# Altium schematic sheet NNP-DWG-125-001-000 PG4 Schematic Drawing Pg3.SchDoc
size B; CheckedBy: A. Zbrzeski; DrawnBy: R.Yoder; Engineer: R.Yoder; Organization: Synapse Biomedical Inc.; Address1: 300 Artino St.; Address2: Oberlin, OH 44074; DocumentNumber: 51-2002-01; Revision: 04; SheetNumber: 3; SheetTotal: 8; PageSetup: Record=PageOptions|CenterHorizontal=True|CenterVertical=True|PrintScale=1.09|XCorrection=1.00|YCorrection=1.00|PrintKind=0|BorderSize=5000000|LeftOffset=0|BottomOffset=0|Orientation=2|PaperLength=4318|PaperWidth=2794|Scale=100|PaperSource=7|PrintQuality=-3|MediaType=1|DitherType=10|PrintScaleMode=1|PaperKind=11" x 17"|PaperIndex=17
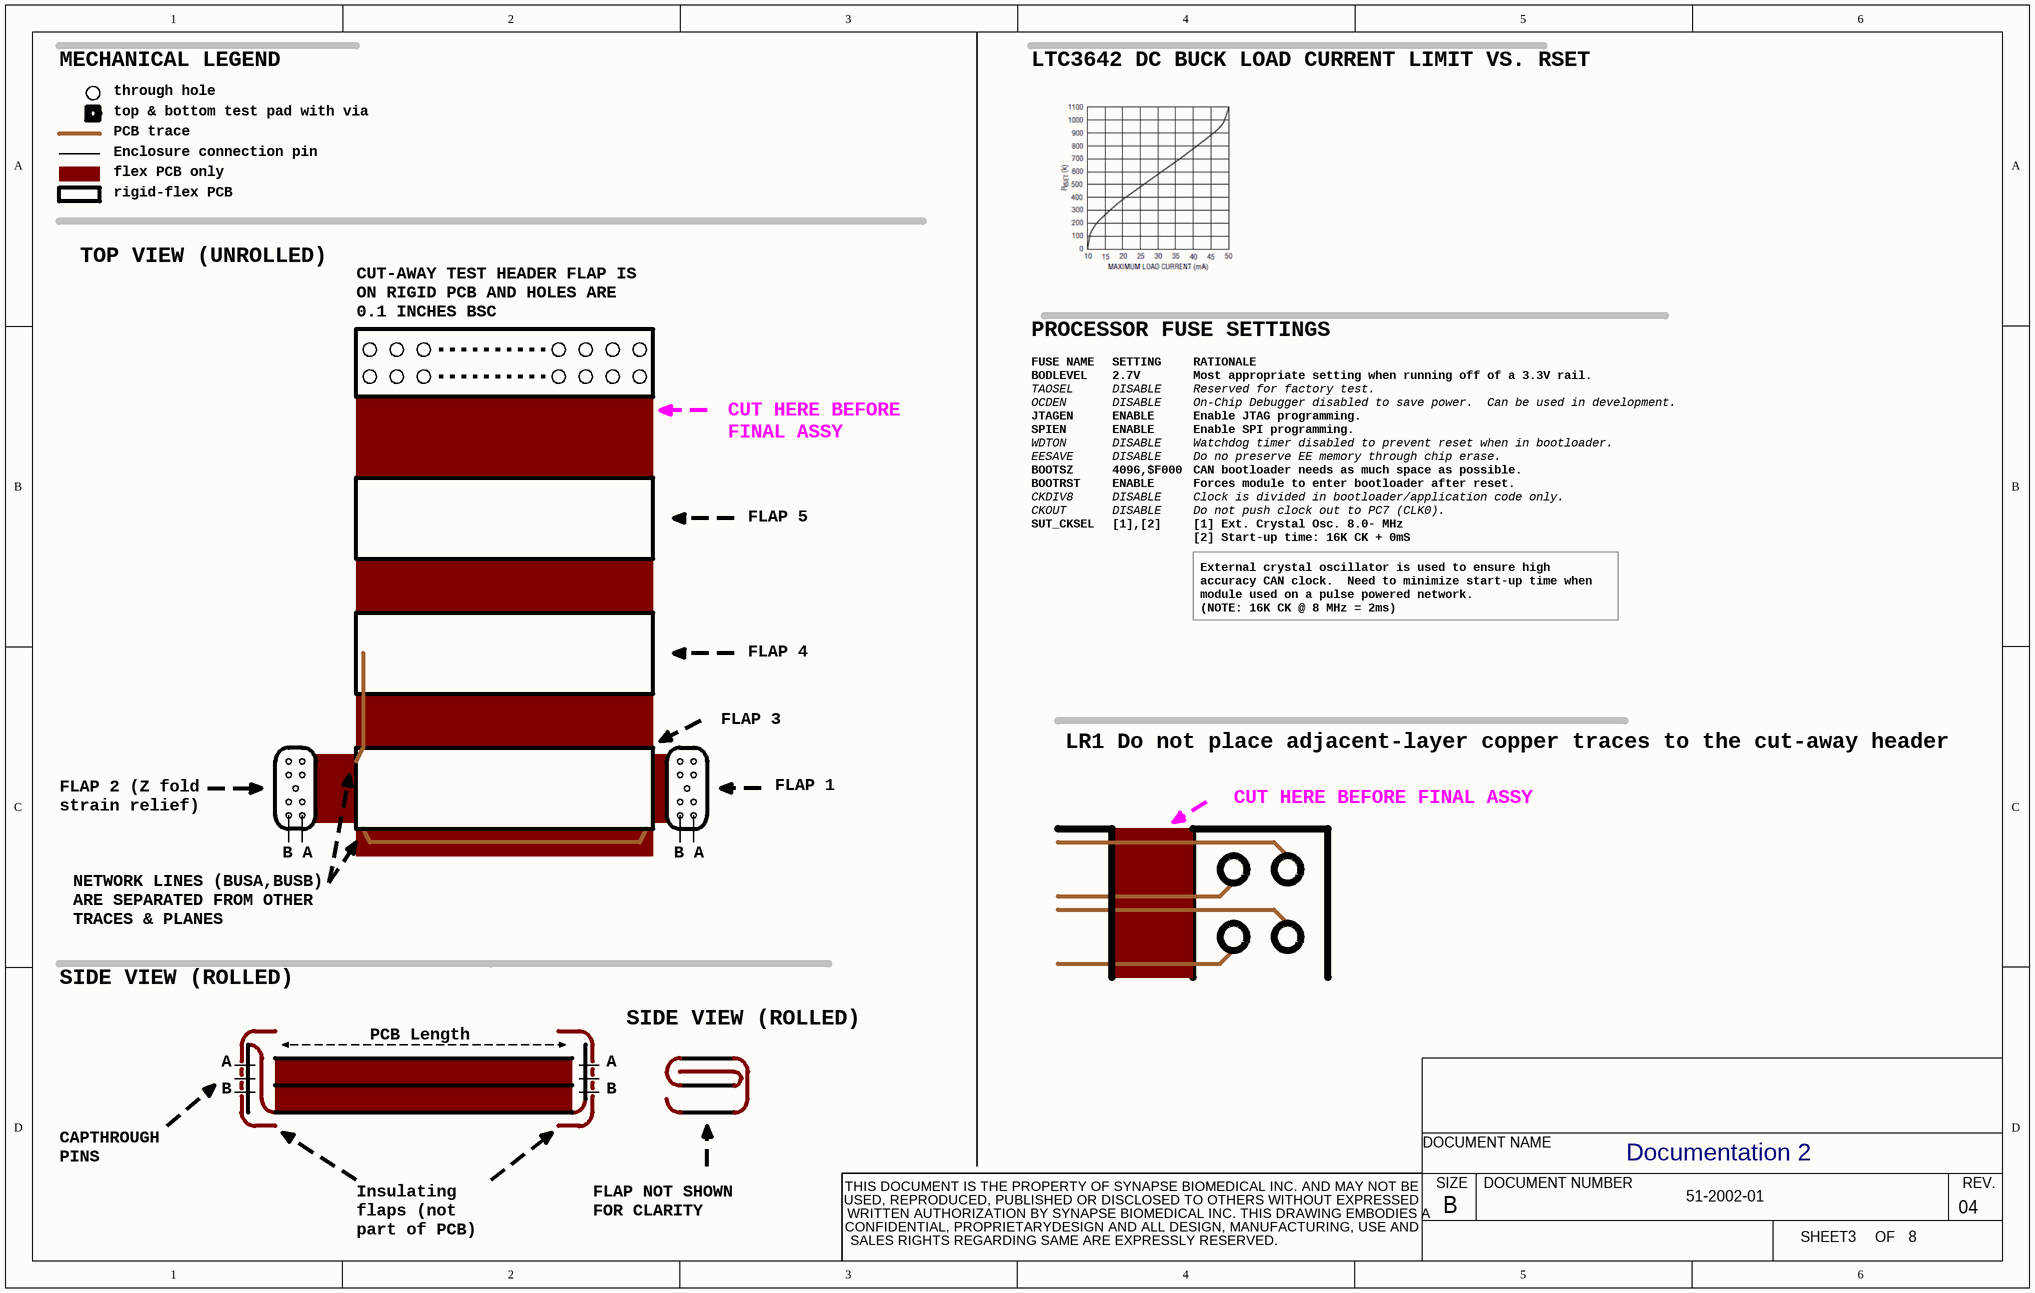
[diagram p0: NNP-DWG-125-001-000 PG4 Schematic Drawing Pg3.SchDoc]

## Notes on the sheet
- MECHANICAL LEGEND
- through hole
- LTC3642 DC BUCK LOAD CURRENT LIMIT VS. RSET
- top & bottom test pad with via
- PCB trace
- Enclosure connection pin
- flex PCB only
- rigid-flex PCB
- TOP VIEW (UNROLLED)
- CUT-AWAY TEST HEADER FLAP IS ON RIGID PCB AND HOLES ARE 0.1 INCHES BSC
- FUSE NAME
- PROCESSOR FUSE SETTINGS
- SETTING
- RATIONALE
- CUT HERE BEFORE FINAL ASSY
- BODLEVEL
- OCDEN
- JTAGEN
- SPIEN
- TAOSEL
- 2.7V
- DISABLE
- ENABLE
- Most appropriate setting when running off of a 3.3V rail.
- On-Chip Debugger disabled to save power.  Can be used in development.
- Enable JTAG programming.
- Enable SPI programming.
- Reserved for factory test.
- WDTON
- EESAVE
- BOOTSZ
- BOOTRST
- CKDIV8
- 4096,$F000
- Forces module to enter bootloader after reset.
- Clock is divided in bootloader/application code only.
- CAN bootloader needs as much space as possible.
- Watchdog timer disabled to prevent reset when in bootloader.
- Do no preserve EE memory through chip erase.
- FLAP 5
- CKOUT
- SUT_CKSEL
- [1],[2]
- Do not push clock out to PC7 (CLK0).
- [1] Ext. Crystal Osc. 8.0- MHz
- [2] Start-up time: 16K CK + 0mS
- External crystal oscillator is used to ensure high accuracy CAN clock.  Need to minimize start-up time when module used on a pulse powered network.
  (NOTE: 16K CK @ 8 MHz = 2ms)
- FLAP 4
- FLAP 3
- LR1 Do not place adjacent-layer copper traces to the cut-away header
- FLAP 2 (Z fold strain relief)
- FLAP 1
- B
- A
- NETWORK LINES (BUSA,BUSB) ARE SEPARATED FROM OTHER TRACES & PLANES
- SIDE VIEW (ROLLED)
- PCB Length
- CAPTHROUGH PINS
- Documentation 2
- Insulating flaps (not part of PCB)
- FLAP NOT SHOWN FOR CLARITY
- THIS DOCUMENT IS THE PROPERTY OF SYNAPSE BIOMEDICAL INC. AND MAY NOT BE
- DOCUMENT NAME
- SALES RIGHTS REGARDING SAME ARE EXPRESSLY RESERVED.
- USED, REPRODUCED, PUBLISHED OR DISCLOSED TO OTHERS WITHOUT EXPRESSED
- CONFIDENTIAL, PROPRIETARYDESIGN AND ALL DESIGN, MANUFACTURING, USE AND
- WRITTEN AUTHORIZATION BY SYNAPSE BIOMEDICAL INC. THIS DRAWING EMBODIES A
- SIZE
- DOCUMENT NUMBER
- SHEET
- OF
- REV.